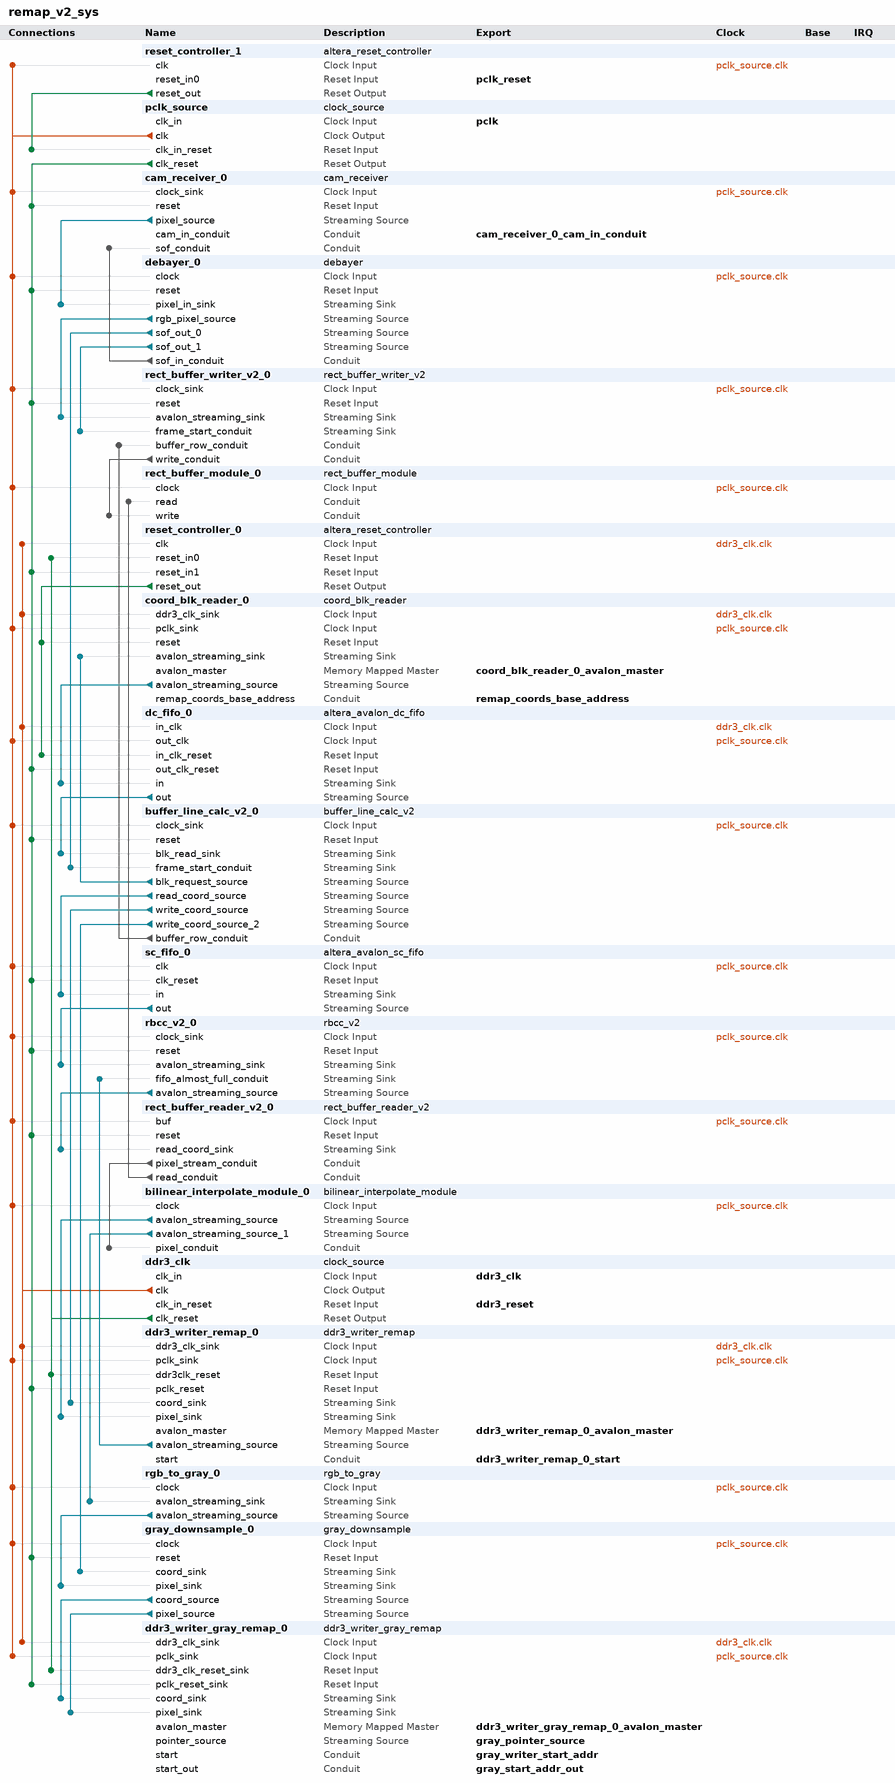
[diagram p0: system contents]
# Platform Designer (Qsys) system remap_v2_sys, Cyclone V 5CSEBA6U23I7
# Parameters at their usual value, and those the tool derives, are not listed.
package require -exact qsys 18.1
create_system remap_v2_sys
set_project_property DEVICE_FAMILY {Cyclone V}
set_project_property DEVICE 5CSEBA6U23I7

add_instance reset_controller_1 altera_reset_controller 18.1
set_instance_parameter_value reset_controller_1 NUM_RESET_INPUTS 1
set_instance_parameter_value reset_controller_1 OUTPUT_RESET_SYNC_EDGES both
set_instance_parameter_value reset_controller_1 SYNC_DEPTH 2

add_instance pclk_source clock_source 18.1
set_instance_parameter_value pclk_source clockFrequency 50000000

add_instance cam_receiver_0 cam_receiver 1.0
set_instance_parameter_value cam_receiver_0 frame_lines 1540
set_instance_parameter_value cam_receiver_0 frame_width 2052

add_instance debayer_0 debayer 1.0
set_instance_parameter_value debayer_0 line_length 2052

add_instance rect_buffer_writer_v2_0 rect_buffer_writer_v2 1.0
set_instance_parameter_value rect_buffer_writer_v2_0 buffer_h 16
set_instance_parameter_value rect_buffer_writer_v2_0 buffer_w 2048

add_instance rect_buffer_module_0 rect_buffer_module 1.0

add_instance reset_controller_0 altera_reset_controller 18.1
set_instance_parameter_value reset_controller_0 NUM_RESET_INPUTS 2
set_instance_parameter_value reset_controller_0 OUTPUT_RESET_SYNC_EDGES both
set_instance_parameter_value reset_controller_0 SYNC_DEPTH 2

add_instance coord_blk_reader_0 coord_blk_reader 1.0

add_instance dc_fifo_0 altera_avalon_dc_fifo 18.1
set_instance_parameter_value dc_fifo_0 BITS_PER_SYMBOL 168
set_instance_parameter_value dc_fifo_0 FIFO_DEPTH 64
set_instance_parameter_value dc_fifo_0 USE_PACKETS 0

add_instance buffer_line_calc_v2_0 buffer_line_calc_v2 1.0
set_instance_parameter_value buffer_line_calc_v2_0 coord_frac_bits 2
set_instance_parameter_value buffer_line_calc_v2_0 wr_blk_h 32
set_instance_parameter_value buffer_line_calc_v2_0 wr_blk_w 32
set_instance_parameter_value buffer_line_calc_v2_0 wr_frame_h 1920
set_instance_parameter_value buffer_line_calc_v2_0 wr_frame_w 1440

add_instance sc_fifo_0 altera_avalon_sc_fifo 18.1
set_instance_parameter_value sc_fifo_0 BITS_PER_SYMBOL 66
set_instance_parameter_value sc_fifo_0 CHANNEL_WIDTH 0
set_instance_parameter_value sc_fifo_0 ERROR_WIDTH 0
set_instance_parameter_value sc_fifo_0 FIFO_DEPTH 16
set_instance_parameter_value sc_fifo_0 USE_FILL_LEVEL 0
set_instance_parameter_value sc_fifo_0 USE_MEMORY_BLOCKS 1
set_instance_parameter_value sc_fifo_0 USE_STORE_FORWARD 0

add_instance rbcc_v2_0 rbcc_v2 1.0
set_instance_parameter_value rbcc_v2_0 coord_frac_bits 2
set_instance_parameter_value rbcc_v2_0 wr_blk_h 32
set_instance_parameter_value rbcc_v2_0 wr_blk_w 32

add_instance rect_buffer_reader_v2_0 rect_buffer_reader_v2 1.0
set_instance_parameter_value rect_buffer_reader_v2_0 buffer_h 16
set_instance_parameter_value rect_buffer_reader_v2_0 buffer_w 2048

add_instance bilinear_interpolate_module_0 bilinear_interpolate_module 1.0

add_instance ddr3_clk clock_source 18.1
set_instance_parameter_value ddr3_clk clockFrequency 100000000

add_instance ddr3_writer_remap_0 ddr3_writer_remap 1.0
set_instance_parameter_value ddr3_writer_remap_0 burst_log 2
set_instance_parameter_value ddr3_writer_remap_0 horiz 1
set_instance_parameter_value ddr3_writer_remap_0 in_width 16
set_instance_parameter_value ddr3_writer_remap_0 rotate_buffers 0

add_instance rgb_to_gray_0 rgb_to_gray 1.0

add_instance gray_downsample_0 gray_downsample 1.0
set_instance_parameter_value gray_downsample_0 wr_blk_w 32
set_instance_parameter_value gray_downsample_0 wr_frame_w 1440

add_instance ddr3_writer_gray_remap_0 ddr3_writer_gray_remap 1.0
set_instance_parameter_value ddr3_writer_gray_remap_0 horiz 1
set_instance_parameter_value ddr3_writer_gray_remap_0 max_x 720
set_instance_parameter_value ddr3_writer_gray_remap_0 min_x 240
set_instance_parameter_value ddr3_writer_gray_remap_0 rotate_buffers 0

# connections
add_connection ddr3_clk.clk coord_blk_reader_0.ddr3_clk_sink clock
add_connection ddr3_clk.clk dc_fifo_0.in_clk clock
add_connection ddr3_clk.clk ddr3_writer_gray_remap_0.ddr3_clk_sink clock
add_connection ddr3_clk.clk ddr3_writer_remap_0.ddr3_clk_sink clock
add_connection ddr3_clk.clk reset_controller_0.clk clock
add_connection pclk_source.clk bilinear_interpolate_module_0.clock clock
add_connection pclk_source.clk buffer_line_calc_v2_0.clock_sink clock
add_connection pclk_source.clk cam_receiver_0.clock_sink clock
add_connection pclk_source.clk coord_blk_reader_0.pclk_sink clock
add_connection pclk_source.clk dc_fifo_0.out_clk clock
add_connection pclk_source.clk ddr3_writer_gray_remap_0.pclk_sink clock
add_connection pclk_source.clk ddr3_writer_remap_0.pclk_sink clock
add_connection pclk_source.clk debayer_0.clock clock
add_connection pclk_source.clk gray_downsample_0.clock clock
add_connection pclk_source.clk rbcc_v2_0.clock_sink clock
add_connection pclk_source.clk rect_buffer_module_0.clock clock
add_connection pclk_source.clk rect_buffer_reader_v2_0.buf clock
add_connection pclk_source.clk rect_buffer_writer_v2_0.clock_sink clock
add_connection pclk_source.clk reset_controller_1.clk clock
add_connection pclk_source.clk rgb_to_gray_0.clock clock
add_connection pclk_source.clk sc_fifo_0.clk clock
add_connection ddr3_clk.clk_reset ddr3_writer_gray_remap_0.ddr3_clk_reset_sink reset
add_connection ddr3_clk.clk_reset ddr3_writer_remap_0.ddr3clk_reset reset
add_connection ddr3_clk.clk_reset reset_controller_0.reset_in0 reset
add_connection pclk_source.clk_reset buffer_line_calc_v2_0.reset reset
add_connection pclk_source.clk_reset cam_receiver_0.reset reset
add_connection pclk_source.clk_reset dc_fifo_0.out_clk_reset reset
add_connection pclk_source.clk_reset ddr3_writer_gray_remap_0.pclk_reset_sink reset
add_connection pclk_source.clk_reset ddr3_writer_remap_0.pclk_reset reset
add_connection pclk_source.clk_reset debayer_0.reset reset
add_connection pclk_source.clk_reset gray_downsample_0.reset reset
add_connection pclk_source.clk_reset rbcc_v2_0.reset reset
add_connection pclk_source.clk_reset rect_buffer_reader_v2_0.reset reset
add_connection pclk_source.clk_reset rect_buffer_writer_v2_0.reset reset
add_connection pclk_source.clk_reset reset_controller_0.reset_in1 reset
add_connection pclk_source.clk_reset sc_fifo_0.clk_reset reset
add_connection reset_controller_0.reset_out coord_blk_reader_0.reset reset
add_connection reset_controller_0.reset_out dc_fifo_0.in_clk_reset reset
add_connection reset_controller_1.reset_out pclk_source.clk_in_reset reset
add_connection bilinear_interpolate_module_0.avalon_streaming_source ddr3_writer_remap_0.pixel_sink avalon_streaming
add_connection bilinear_interpolate_module_0.avalon_streaming_source_1 rgb_to_gray_0.avalon_streaming_sink avalon_streaming
add_connection buffer_line_calc_v2_0.blk_request_source coord_blk_reader_0.avalon_streaming_sink avalon_streaming
add_connection buffer_line_calc_v2_0.read_coord_source sc_fifo_0.in avalon_streaming
add_connection buffer_line_calc_v2_0.write_coord_source ddr3_writer_remap_0.coord_sink avalon_streaming
add_connection buffer_line_calc_v2_0.write_coord_source_2 gray_downsample_0.coord_sink avalon_streaming
add_connection cam_receiver_0.pixel_source debayer_0.pixel_in_sink avalon_streaming
add_connection coord_blk_reader_0.avalon_streaming_source dc_fifo_0.in avalon_streaming
add_connection dc_fifo_0.out buffer_line_calc_v2_0.blk_read_sink avalon_streaming
add_connection ddr3_writer_remap_0.avalon_streaming_source rbcc_v2_0.fifo_almost_full_conduit avalon_streaming
add_connection debayer_0.rgb_pixel_source rect_buffer_writer_v2_0.avalon_streaming_sink avalon_streaming
add_connection debayer_0.sof_out_0 buffer_line_calc_v2_0.frame_start_conduit avalon_streaming
add_connection debayer_0.sof_out_1 rect_buffer_writer_v2_0.frame_start_conduit avalon_streaming
add_connection gray_downsample_0.coord_source ddr3_writer_gray_remap_0.coord_sink avalon_streaming
add_connection gray_downsample_0.pixel_source ddr3_writer_gray_remap_0.pixel_sink avalon_streaming
add_connection rbcc_v2_0.avalon_streaming_source rect_buffer_reader_v2_0.read_coord_sink avalon_streaming
add_connection rgb_to_gray_0.avalon_streaming_source gray_downsample_0.pixel_sink avalon_streaming
add_connection sc_fifo_0.out rbcc_v2_0.avalon_streaming_sink avalon_streaming
add_connection buffer_line_calc_v2_0.buffer_row_conduit rect_buffer_writer_v2_0.buffer_row_conduit conduit
add_connection debayer_0.sof_in_conduit cam_receiver_0.sof_conduit conduit
add_connection rect_buffer_reader_v2_0.pixel_stream_conduit bilinear_interpolate_module_0.pixel_conduit conduit
add_connection rect_buffer_reader_v2_0.read_conduit rect_buffer_module_0.read conduit
add_connection rect_buffer_writer_v2_0.write_conduit rect_buffer_module_0.write conduit

# exported interfaces
add_interface cam_receiver_0_cam_in_conduit conduit end
set_interface_property cam_receiver_0_cam_in_conduit EXPORT_OF cam_receiver_0.cam_in_conduit
add_interface coord_blk_reader_0_avalon_master avalon master
set_interface_property coord_blk_reader_0_avalon_master EXPORT_OF coord_blk_reader_0.avalon_master
add_interface ddr3_clk clock sink
set_interface_property ddr3_clk EXPORT_OF ddr3_clk.clk_in
add_interface ddr3_reset reset sink
set_interface_property ddr3_reset EXPORT_OF ddr3_clk.clk_in_reset
add_interface ddr3_writer_gray_remap_0_avalon_master avalon master
set_interface_property ddr3_writer_gray_remap_0_avalon_master EXPORT_OF ddr3_writer_gray_remap_0.avalon_master
add_interface ddr3_writer_remap_0_avalon_master avalon master
set_interface_property ddr3_writer_remap_0_avalon_master EXPORT_OF ddr3_writer_remap_0.avalon_master
add_interface ddr3_writer_remap_0_start conduit end
set_interface_property ddr3_writer_remap_0_start EXPORT_OF ddr3_writer_remap_0.start
add_interface gray_pointer_source avalon_streaming source
set_interface_property gray_pointer_source EXPORT_OF ddr3_writer_gray_remap_0.pointer_source
add_interface gray_start_addr_out conduit end
set_interface_property gray_start_addr_out EXPORT_OF ddr3_writer_gray_remap_0.start_out
add_interface gray_writer_start_addr conduit end
set_interface_property gray_writer_start_addr EXPORT_OF ddr3_writer_gray_remap_0.start
add_interface pclk clock sink
set_interface_property pclk EXPORT_OF pclk_source.clk_in
add_interface pclk_reset reset sink
set_interface_property pclk_reset EXPORT_OF reset_controller_1.reset_in0
add_interface remap_coords_base_address conduit end
set_interface_property remap_coords_base_address EXPORT_OF coord_blk_reader_0.remap_coords_base_address

set_interconnect_requirement {$system} qsys_mm.clockCrossingAdapter HANDSHAKE
set_interconnect_requirement {$system} qsys_mm.enableEccProtection FALSE
set_interconnect_requirement {$system} qsys_mm.insertDefaultSlave FALSE
set_interconnect_requirement {$system} qsys_mm.maxAdditionalLatency 1

save_system remap_v2_sys.qsys
